# EAGLE schematic riffle-MIN-E-routed (EAGLE 6.5.0)
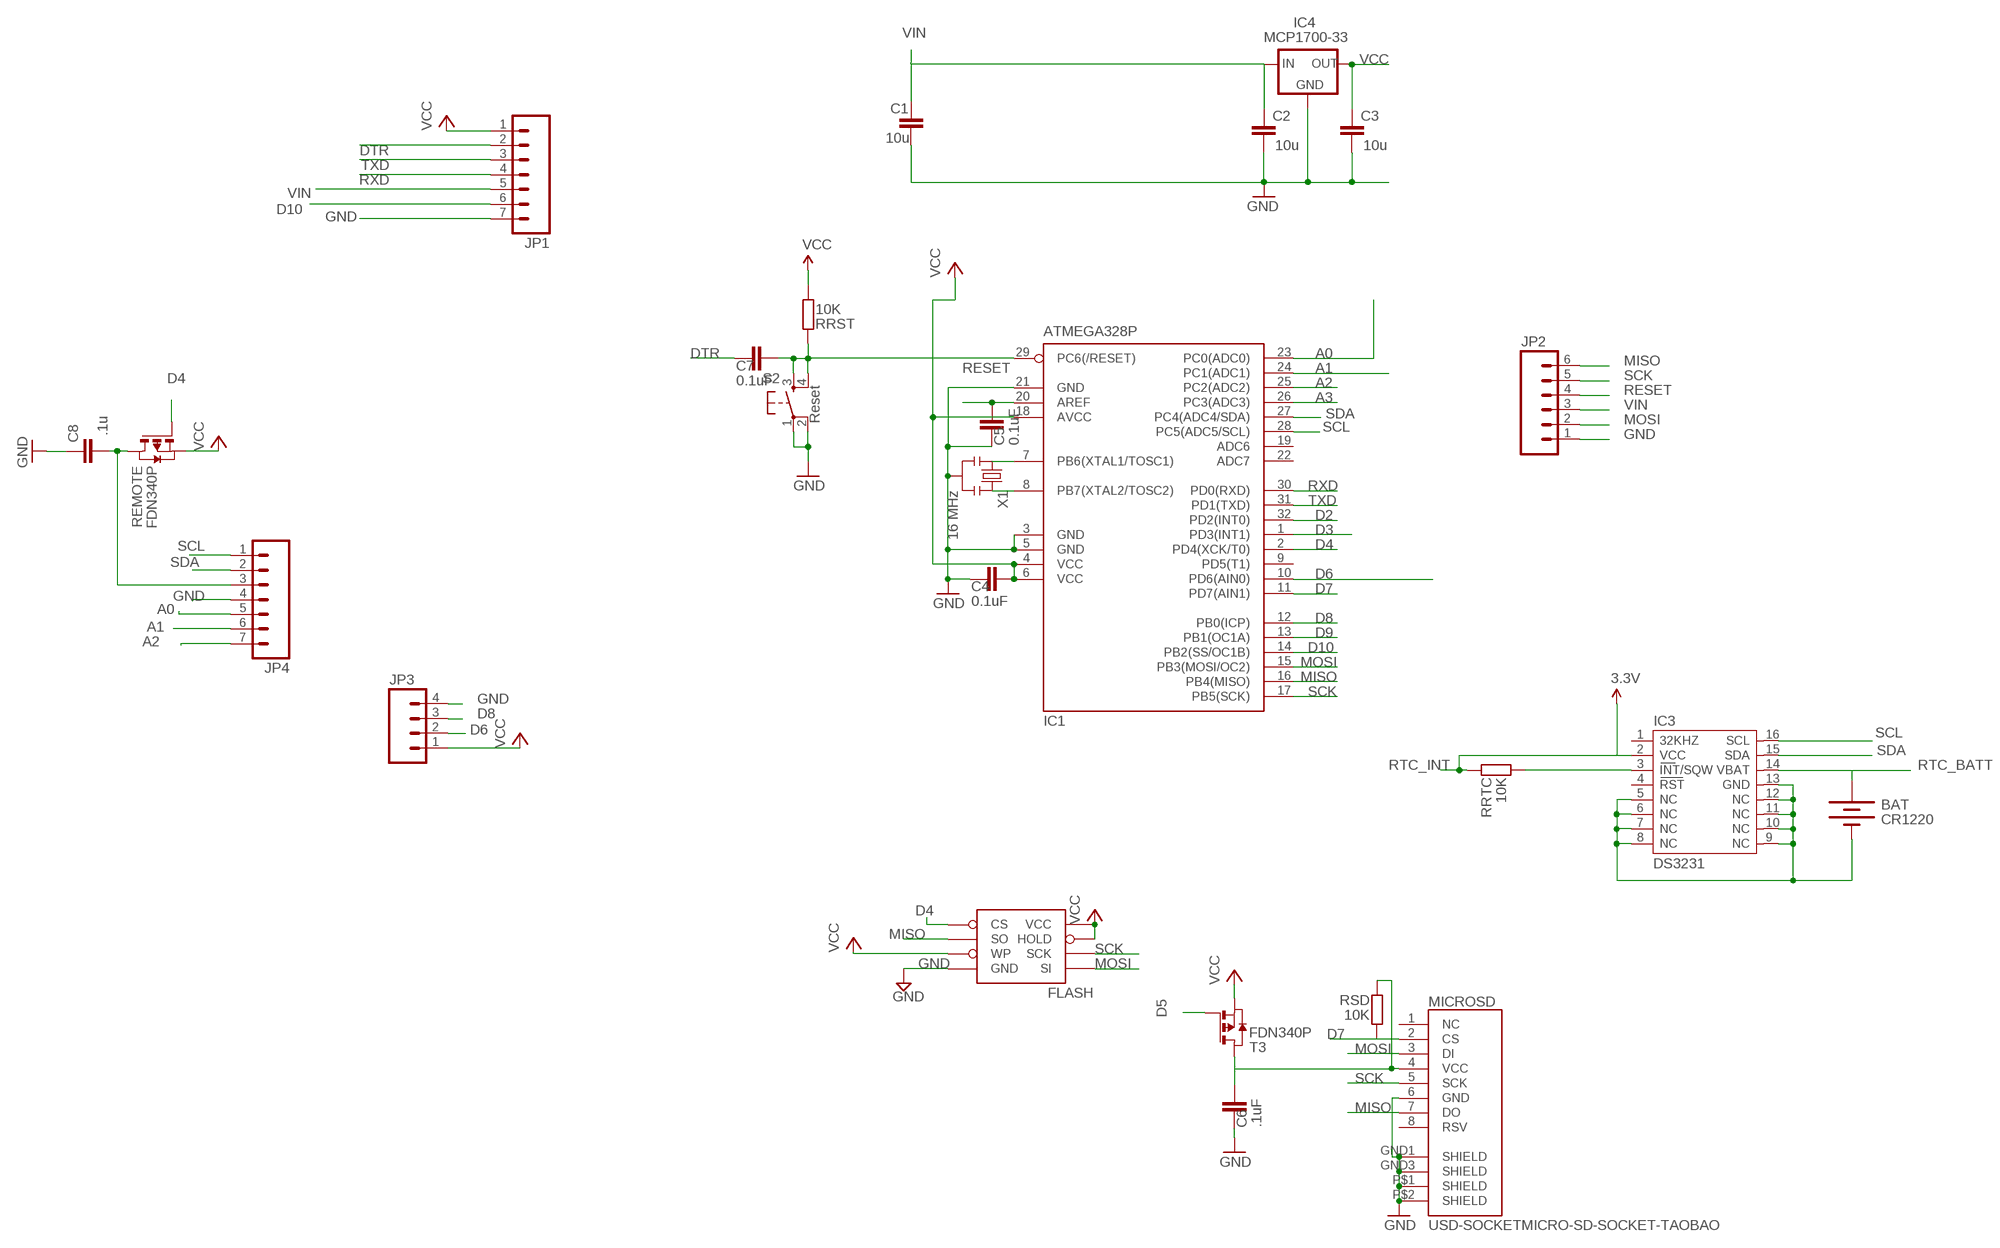
[diagram p0: schematic, sheet 1]

## Parts
BAT  CR1220  BATTERYBATTERY_12MM_SMT  [BATTCON_12MM_SMT]
C1  10u  C-EUC0805  [C0805]
C2  10u  C-EUC0805  [C0805]
C3  10u  C-EUC0805  [C0805]
C4  0.1uF  C-EUC0805  [C0805@1]
C5  0.1uF  C-EUC0805  [C0805@1]
C6  .1uF  C-EUC0805  [C0805@1]
C7  0.1uF  C-EUC0805  [C0805@1]
C8  .1u  C-EUC0805  [C0805]
FLASH  AT25F512BWIDE_5.3MM  [SO08WIDE]
IC1  ATMEGA328P  MEGA8-AI  [TQFP32-08]
IC3  DS3231  [DS3231]
IC4  MCP1700-33  MCP1700SOT233  [SOT23]
JP1  M07  [1X07]
JP2  M06LOCK  [1X06_LOCK]
JP3  M04LOCK  [1X04_LOCK]
JP4  M07  [1X07]
MICROSD  USD-SOCKETMICRO-SD-SOCKET-TAOBAO  [MICRO-SD-SOCKET-TAOBAO]
REMOTE  FDN340P  PMOSSOT23  [SOT-23]
RRST  10K  R-EU_R0805  [R0805]
RRTC  10K  R-EU_R0805  [R0805]
RSD  10K  R-EU_R0805  [R0805]
S2  Reset  TAC_SWITCHSMD  [TACTILE_SWITCH_SMD]
T3  FDN340P  PMOSSOT23  [SOT-23]
X1  16 MHz  RESONATORSMD  [RESONATOR-SMD]

## Nets
A0: IC1.23(PC0(ADC0)) JP4.5
A1: IC1.24(PC1(ADC1)) JP4.6
A2: IC1.25(PC2(ADC2)) JP4.7
A3: IC1.26(PC3(ADC3))
AREF: C5.2 IC1.20(AREF)
D2: IC1.32(PD2(INT0))
D3: IC1.1(PD3(INT1))
D4: FLASH.1(CS) IC1.2(PD4(XCK/T0)) REMOTE.3(G)
D5: T3.3(G)
D6: IC1.10(PD6(AIN0)) JP3.2
D7: IC1.11(PD7(AIN1)) MICROSD.2(CS) RSD.1
D8: IC1.12(PB0(ICP)) JP3.3
D9: IC1.13(PB1(OC1A))
D10: IC1.14(PB2(SS/OC1B)) JP1.6
DTR: C7.1 JP1.2
GND: BAT.P$1(-) C1.2 C2.2 C3.2 C4.1 C5.1 C6.1 C8.1 FLASH.4(GND) IC1.3(GND) IC1.5(GND) IC1.21(GND) IC3.5(NC) IC3.6(NC) IC3.7(NC) IC3.8(NC) IC3.9(NC) IC3.10(NC) IC3.11(NC) IC3.12(NC) IC3.13(GND) IC4.1(GND) JP1.7 JP2.1 JP3.4 JP4.4 MICROSD.6(GND) MICROSD.GND1(SHIELD) MICROSD.GND3(SHIELD) MICROSD.P$1(SHIELD) MICROSD.P$2(SHIELD) S2.1 S2.2 X1.2
MISO: FLASH.2(SO) IC1.16(PB4(MISO)) JP2.6 MICROSD.7(DO)
MOSI: FLASH.5(SI) IC1.15(PB3(MOSI/OC2)) JP2.2 MICROSD.3(DI)
N$2: IC1.8(PB7(XTAL2/TOSC2)) X1.3
N$3: IC1.7(PB6(XTAL1/TOSC1)) X1.1
N$16: IC3.3(INT/SQW) RRTC.1
N$31: C6.2 MICROSD.4(VCC) RSD.2 T3.1(D)
RESET: IC1.29(PC6(/RESET)) JP2.4
RESET1: C7.2 RRST.2 S2.3 S2.4
RTC_BATT: BAT.P$2(+) IC3.14(VBAT)
RTC_INT: IC3.2(VCC) RRTC.2 ; supply symbol labelled 3.3V
RXD: IC1.30(PD0(RXD)) JP1.4
SCK: FLASH.6(SCK) IC1.17(PB5(SCK)) JP2.5 MICROSD.5(SCK)
SCL: IC1.28(PC5(ADC5/SCL)) IC3.16(SCL) JP4.1
SDA: IC1.27(PC4(ADC4/SDA)) IC3.15(SDA) JP4.2
TXD: IC1.31(PD1(TXD)) JP1.3
VCC: C3.1 C4.2 C8.2 FLASH.3(WP) FLASH.7(HOLD) FLASH.8(VCC) IC1.4(VCC) IC1.6(VCC) IC1.18(AVCC) IC4.2(OUT) JP1.1 JP3.1 JP4.3 REMOTE.1(D) REMOTE.2(S) RRST.1 T3.2(S)
VIN [power]: C1.1 C2.1 IC4.3(IN) JP1.5 JP2.3
Unconnected: IC1.9(PD5(T1)) IC1.19(ADC6) IC1.22(ADC7) IC3.1(32KHZ) IC3.4(RST) MICROSD.1(NC) MICROSD.8(RSV)

## Library data of the parts
BAT = SparkFunNew:BATTERY: Battery Holders Various common sizes : AA, AAA, 20mm coin cell and 12mm coin cell.
C1-C3 C8 = resistor:C-EU: CAPACITOR, European symbol
C4-C7 = rcl:C-EU: CAPACITOR, European symbol
FLASH = LowPowerLab:AT25F512B: 4-Mbit SPI flash memory
IC1 = atmel:MEGA8: MICROCONTROLLER 8 Kbytes FLASH, 1 kbytes SRAM, 512 bytes EEPROM, USART, 6-channel 10 bit ADC, 2-channel 8 bit ADC Pin compatible with Atmega48, ATMega88, ATMega168 Source: avr.lbr; MPN: ATMEGA8-16AU; OC_FARNELL: 9171371; OC_NEWARK: 73M8863
IC3 = _lh-library:DS3231
IC4 = adafruit:MCP1700: VOLTAGE REGULATOR
JP1 JP4 = SparkFun-Connectors:M07: Header 7 Standard 7-pin 0.1" header. Use with straight break away headers (SKU : PRT-00116), right angle break away headers (PRT-00553), swiss pins (PRT-00743), machine pins (PRT-00117), and female headers (PRT-00115). NOTES ON THE VARIANTS LOCK and LOCK_LONGPADS... This footprint was designed to help hold the alignment of a through-hole component (i.e. 7-pin header) while soldering it into place. You may notice that each hole has been shifted either up or down by 0.005 of an inch from it's more standard position (which is usually a perfectly straight line). This slight alteration caused the pins (the squares in the middle) to touch the edges of the holes. Because they are alternating, it causes a "brace" to hold the header in place. 0.005 has proven to be the perfect amount of "off-center" position when using our standard breakaway headers. Although looks a little odd when you look at the bare footprint, once you have a header in there, the alteration is very hard to notice. Also, if you push a header all the way into place, it is covered up entirely on the bottom side. This idea of altering the position of holes to aid alignment will be further integrated into the Sparkfun Library for other footprints. It can help hold any component with 3 or more connection pins.
JP2 = SparkFun-Connectors:M06: Header 6 Standard 6-pin 0.1" header. Use with straight break away headers (SKU : PRT-00116), right angle break away headers (PRT-00553), swiss pins (PRT-00743), machine pins (PRT-00117), and female headers (PRT-00115). Molex polarized connector foot print use with SKU : PRT-08094 with associated crimp pins and housings. NOTES ON THE VARIANTS LOCK and LOCK_LONGPADS... This footprint was designed to help hold the alignment of a through-hole component (i.e. 6-pin header) while soldering it into place. You may notice that each hole has been shifted either up or down by 0.005 of an inch from it's more standard position (which is a perfectly straight line). This slight alteration caused the pins (the squares in the middle) to touch the edges of the holes. Because they are alternating, it causes a "brace" to hold the component in place. 0.005 has proven to be the perfect amount of "off-center" position when using our standard breakaway headers. Although looks a little odd when you look at the bare footprint, once you have a header in there, the alteration is very hard to notice. Also,if you push a header all the way into place, it is covered up entirely on the bottom side. This idea of altering the position of holes to aid alignment will be further integrated into the Sparkfun Library for other footprints. It can help hold any component with 3 or more connection pins.
JP3 = SparkFun-Connectors:M04: Header 4 Standard 4-pin 0.1" header. Use with straight break away headers (SKU : PRT-00116), right angle break away headers (PRT-00553), swiss pins (PRT-00743), machine pins (PRT-00117), and female headers (PRT-00115). Molex polarized connector foot print use with SKU : PRT-08231 with associated crimp pins and housings. 1MM SMD Version SKU: PRT-10208
MICROSD = SparkFunNew:USD-SOCKET: microSD Socket Push-push type uSD socket. Schematic element and footprint production proven. Spark Fun Electronics SKU : PRT-00127. tDoc lines correctly indicate media card edge positions when inserting (unlocked, locked, depressed).
REMOTE T3 = zetex:PMOSSOT23: MOS FET
RRST RRTC RSD = rcl:R-EU_: RESISTOR, European symbol
S2 = SparkFun:TAC_SWITCH: Momentary Switch Button commonly used for reset or general input. Spark Fun Electronics SKU : COM-00097
X1 = SparkFun:RESONATOR: Resonator Small SMD resonator. This is the itty bitty 10/20MHz resonators with built in caps. CSTCE10M0G55 and CSTCE20M0V53. Footprint has been reviewed closely but hasn't been tested yet.

## Net classes
1 power: width 0.381 mm, clearance 0.254 mm